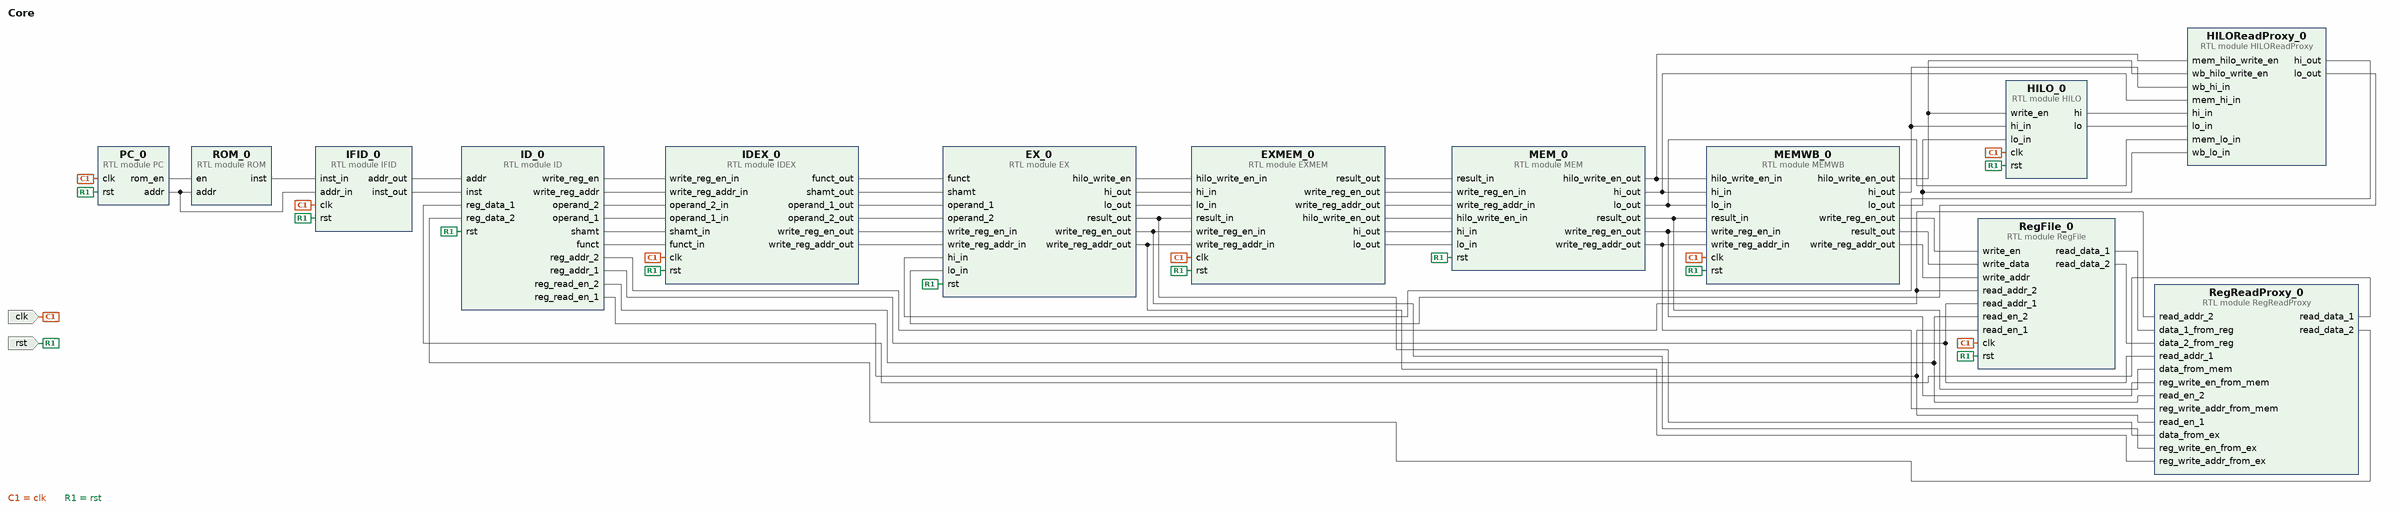
[diagram p0: block diagram of the top level]
# Vivado block design Core, xc7a200tfbg676-2, Vivado 2017.3
create_bd_design Core

create_bd_port -dir I clk
create_bd_port -dir I rst

create_bd_cell -type module -reference IFID IFID_0
create_bd_cell -type module -reference IDEX IDEX_0
create_bd_cell -type module -reference ROM ROM_0
create_bd_cell -type module -reference RegFile RegFile_0
create_bd_cell -type module -reference RegReadProxy RegReadProxy_0
create_bd_cell -type module -reference PC PC_0
create_bd_cell -type module -reference ID ID_0
create_bd_cell -type module -reference EX EX_0
create_bd_cell -type module -reference EXMEM EXMEM_0
create_bd_cell -type module -reference MEM MEM_0
create_bd_cell -type module -reference MEMWB MEMWB_0
create_bd_cell -type module -reference HILO HILO_0
create_bd_cell -type module -reference HILOReadProxy HILOReadProxy_0

# ---- connections ----

connect_bd_net [get_bd_ports clk] \
  [get_bd_pins IFID_0/clk] [get_bd_pins IDEX_0/clk] [get_bd_pins RegFile_0/clk] [get_bd_pins PC_0/clk] \
  [get_bd_pins EXMEM_0/clk] [get_bd_pins MEMWB_0/clk] [get_bd_pins HILO_0/clk]
connect_bd_net [get_bd_ports rst] \
  [get_bd_pins IFID_0/rst] [get_bd_pins IDEX_0/rst] [get_bd_pins RegFile_0/rst] [get_bd_pins PC_0/rst] [get_bd_pins ID_0/rst] \
  [get_bd_pins EX_0/rst] [get_bd_pins EXMEM_0/rst] [get_bd_pins MEM_0/rst] [get_bd_pins MEMWB_0/rst] [get_bd_pins HILO_0/rst]
connect_bd_net [get_bd_pins PC_0/rom_en] [get_bd_pins ROM_0/en]
connect_bd_net [get_bd_pins PC_0/addr] [get_bd_pins IFID_0/addr_in] [get_bd_pins ROM_0/addr]
connect_bd_net [get_bd_pins ROM_0/inst] [get_bd_pins IFID_0/inst_in]
connect_bd_net [get_bd_pins IFID_0/addr_out] [get_bd_pins ID_0/addr]
connect_bd_net [get_bd_pins IFID_0/inst_out] [get_bd_pins ID_0/inst]
connect_bd_net [get_bd_pins ID_0/write_reg_en] [get_bd_pins IDEX_0/write_reg_en_in]
connect_bd_net [get_bd_pins ID_0/write_reg_addr] [get_bd_pins IDEX_0/write_reg_addr_in]
connect_bd_net [get_bd_pins ID_0/operand_2] [get_bd_pins IDEX_0/operand_2_in]
connect_bd_net [get_bd_pins ID_0/operand_1] [get_bd_pins IDEX_0/operand_1_in]
connect_bd_net [get_bd_pins ID_0/shamt] [get_bd_pins IDEX_0/shamt_in]
connect_bd_net [get_bd_pins ID_0/funct] [get_bd_pins IDEX_0/funct_in]
connect_bd_net [get_bd_pins ID_0/reg_addr_2] [get_bd_pins RegFile_0/read_addr_2] [get_bd_pins RegReadProxy_0/read_addr_2]
connect_bd_net [get_bd_pins ID_0/reg_addr_1] [get_bd_pins RegFile_0/read_addr_1] [get_bd_pins RegReadProxy_0/read_addr_1]
connect_bd_net [get_bd_pins ID_0/reg_read_en_2] [get_bd_pins RegFile_0/read_en_2] [get_bd_pins RegReadProxy_0/read_en_2]
connect_bd_net [get_bd_pins ID_0/reg_read_en_1] [get_bd_pins RegFile_0/read_en_1] [get_bd_pins RegReadProxy_0/read_en_1]
connect_bd_net [get_bd_pins IDEX_0/funct_out] [get_bd_pins EX_0/funct]
connect_bd_net [get_bd_pins IDEX_0/shamt_out] [get_bd_pins EX_0/shamt]
connect_bd_net [get_bd_pins IDEX_0/operand_1_out] [get_bd_pins EX_0/operand_1]
connect_bd_net [get_bd_pins IDEX_0/operand_2_out] [get_bd_pins EX_0/operand_2]
connect_bd_net [get_bd_pins IDEX_0/write_reg_en_out] [get_bd_pins EX_0/write_reg_en_in]
connect_bd_net [get_bd_pins IDEX_0/write_reg_addr_out] [get_bd_pins EX_0/write_reg_addr_in]
connect_bd_net [get_bd_pins EX_0/result_out] [get_bd_pins RegReadProxy_0/data_from_ex] [get_bd_pins EXMEM_0/result_in]
connect_bd_net [get_bd_pins EX_0/write_reg_en_out] [get_bd_pins RegReadProxy_0/reg_write_en_from_ex] [get_bd_pins EXMEM_0/write_reg_en_in]
connect_bd_net [get_bd_pins EX_0/write_reg_addr_out] [get_bd_pins RegReadProxy_0/reg_write_addr_from_ex] [get_bd_pins EXMEM_0/write_reg_addr_in]
connect_bd_net [get_bd_pins EXMEM_0/result_out] [get_bd_pins MEM_0/result_in]
connect_bd_net [get_bd_pins EXMEM_0/write_reg_en_out] [get_bd_pins MEM_0/write_reg_en_in]
connect_bd_net [get_bd_pins EXMEM_0/write_reg_addr_out] [get_bd_pins MEM_0/write_reg_addr_in]
connect_bd_net [get_bd_pins MEM_0/result_out] [get_bd_pins RegReadProxy_0/data_from_mem] [get_bd_pins MEMWB_0/result_in]
connect_bd_net [get_bd_pins MEM_0/write_reg_en_out] [get_bd_pins RegReadProxy_0/reg_write_en_from_mem] [get_bd_pins MEMWB_0/write_reg_en_in]
connect_bd_net [get_bd_pins MEM_0/write_reg_addr_out] [get_bd_pins RegReadProxy_0/reg_write_addr_from_mem] [get_bd_pins MEMWB_0/write_reg_addr_in]
connect_bd_net [get_bd_pins MEMWB_0/write_reg_en_out] [get_bd_pins RegFile_0/write_en]
connect_bd_net [get_bd_pins MEMWB_0/result_out] [get_bd_pins RegFile_0/write_data]
connect_bd_net [get_bd_pins MEMWB_0/write_reg_addr_out] [get_bd_pins RegFile_0/write_addr]
connect_bd_net [get_bd_pins RegReadProxy_0/read_data_1] [get_bd_pins ID_0/reg_data_1]
connect_bd_net [get_bd_pins RegReadProxy_0/read_data_2] [get_bd_pins ID_0/reg_data_2]
connect_bd_net [get_bd_pins RegFile_0/read_data_1] [get_bd_pins RegReadProxy_0/data_1_from_reg]
connect_bd_net [get_bd_pins RegFile_0/read_data_2] [get_bd_pins RegReadProxy_0/data_2_from_reg]
connect_bd_net [get_bd_pins MEMWB_0/hilo_write_en_out] [get_bd_pins HILO_0/write_en] [get_bd_pins HILOReadProxy_0/wb_hilo_write_en]
connect_bd_net [get_bd_pins MEMWB_0/hi_out] [get_bd_pins HILO_0/hi_in] [get_bd_pins HILOReadProxy_0/wb_hi_in]
connect_bd_net [get_bd_pins MEMWB_0/lo_out] [get_bd_pins HILO_0/lo_in] [get_bd_pins HILOReadProxy_0/wb_lo_in]
connect_bd_net [get_bd_pins HILO_0/hi] [get_bd_pins HILOReadProxy_0/hi_in]
connect_bd_net [get_bd_pins HILO_0/lo] [get_bd_pins HILOReadProxy_0/lo_in]
connect_bd_net [get_bd_pins EX_0/hilo_write_en] [get_bd_pins EXMEM_0/hilo_write_en_in]
connect_bd_net [get_bd_pins EX_0/hi_out] [get_bd_pins EXMEM_0/hi_in]
connect_bd_net [get_bd_pins EX_0/lo_out] [get_bd_pins EXMEM_0/lo_in]
connect_bd_net [get_bd_pins EXMEM_0/hilo_write_en_out] [get_bd_pins MEM_0/hilo_write_en_in]
connect_bd_net [get_bd_pins EXMEM_0/hi_out] [get_bd_pins MEM_0/hi_in]
connect_bd_net [get_bd_pins EXMEM_0/lo_out] [get_bd_pins MEM_0/lo_in]
connect_bd_net [get_bd_pins MEM_0/hilo_write_en_out] [get_bd_pins MEMWB_0/hilo_write_en_in] [get_bd_pins HILOReadProxy_0/mem_hilo_write_en]
connect_bd_net [get_bd_pins MEM_0/hi_out] [get_bd_pins MEMWB_0/hi_in] [get_bd_pins HILOReadProxy_0/mem_hi_in]
connect_bd_net [get_bd_pins MEM_0/lo_out] [get_bd_pins MEMWB_0/lo_in] [get_bd_pins HILOReadProxy_0/mem_lo_in]
connect_bd_net [get_bd_pins HILOReadProxy_0/hi_out] [get_bd_pins EX_0/hi_in]
connect_bd_net [get_bd_pins HILOReadProxy_0/lo_out] [get_bd_pins EX_0/lo_in]

validate_bd_design
save_bd_design
